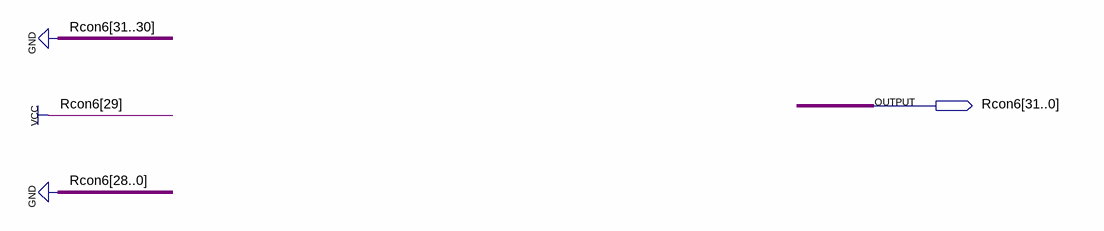
[diagram p0: schematic sheet]
// Quartus schematic Rcon6.bdf as structural Verilog: 0 symbols, 1 pins
module Rcon6 (
  output [31:0] Rcon6
);


  assign Rcon6 = 32'b00100000000000000000000000000000;
endmodule
